# Altium schematic sheet NodoWifi_CPU1.SchDoc
size A4; SheetNumber: 4; SheetTotal: 5
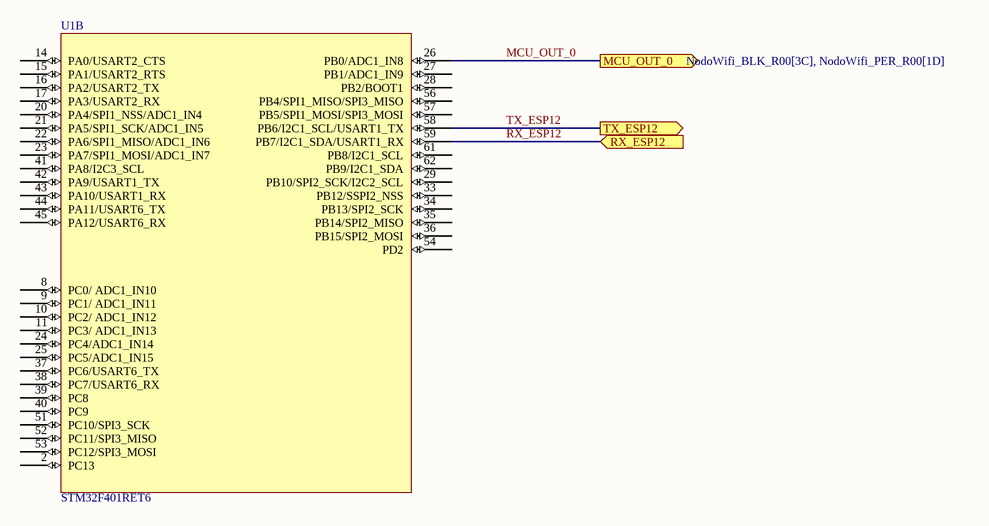
[diagram p0: NodoWifi_CPU1.SchDoc]

## Parts
U1  STM32F401RET6  [LQFP_64]  (part B of 2)

## Ports
MCU_OUT_0 (out, see NodoWifi_BLK_R00[3C], NodoWifi_PER_R00[1D]), RX_ESP12 (in, see NodoWifi_BLK_R00[3C], NodoWifi_PER_R00[2A]), TX_ESP12 (out, see NodoWifi_BLK_R00[3C], NodoWifi_PER_R00[2A])

## Nets
MCU_OUT_0: U1.26(PB0/ADC1_IN8) ; port MCU_OUT_0
RX_ESP12: U1.59(PB7/I2C1_SDA/USART1_RX) ; port RX_ESP12
TX_ESP12: U1.58(PB6/I2C1_SCL/USART1_TX) ; port TX_ESP12

Not connected (* = marked no-connect by the designer): U1 2(PC13) 8(PC0/_ADC1_IN10) 9(PC1/_ADC1_IN11) 10(PC2/_ADC1_IN12) 11(PC3/_ADC1_IN13) 14(PA0/USART2_CTS) 15(PA1/USART2_RTS) 16(PA2/USART2_TX) 17(PA3/USART2_RX) 20(PA4/SPI1_NSS/ADC1_IN4) 21(PA5/SPI1_SCK/ADC1_IN5) 22(PA6/SPI1_MISO/ADC1_IN6) 23(PA7/SPI1_MOSI/ADC1_IN7) 24(PC4/ADC1_IN14) 25(PC5/ADC1_IN15) 27(PB1/ADC1_IN9) 28(PB2/BOOT1) 29(PB10/SPI2_SCK/I2C2_SCL) 33(PB12/SSPI2_NSS) 34(PB13/SPI2_SCK) 35(PB14/SPI2_MISO) 36(PB15/SPI2_MOSI) 37(PC6/USART6_TX) 38(PC7/USART6_RX) 39(PC8) 40(PC9) 41(PA8/I2C3_SCL) 42(PA9/USART1_TX) 43(PA10/USART1_RX) 44(PA11/USART6_TX) 45(PA12/USART6_RX) 51(PC10/SPI3_SCK) 52(PC11/SPI3_MISO) 53(PC12/SPI3_MOSI) 54(PD2) 56(PB4/SPI1_MISO/SPI3_MISO) 57(PB5/SPI1_MOSI/SPI3_MOSI) 61(PB8/I2C1_SCL) 62(PB9/I2C1_SDA)

## Library data of the parts
U1 = STM32F401RE